# Altium schematic sheet lpGBT-Power.SchDoc: lpGBT Power
size A; DocumentNumber: 10; SheetNumber: 10; SheetTotal: 22
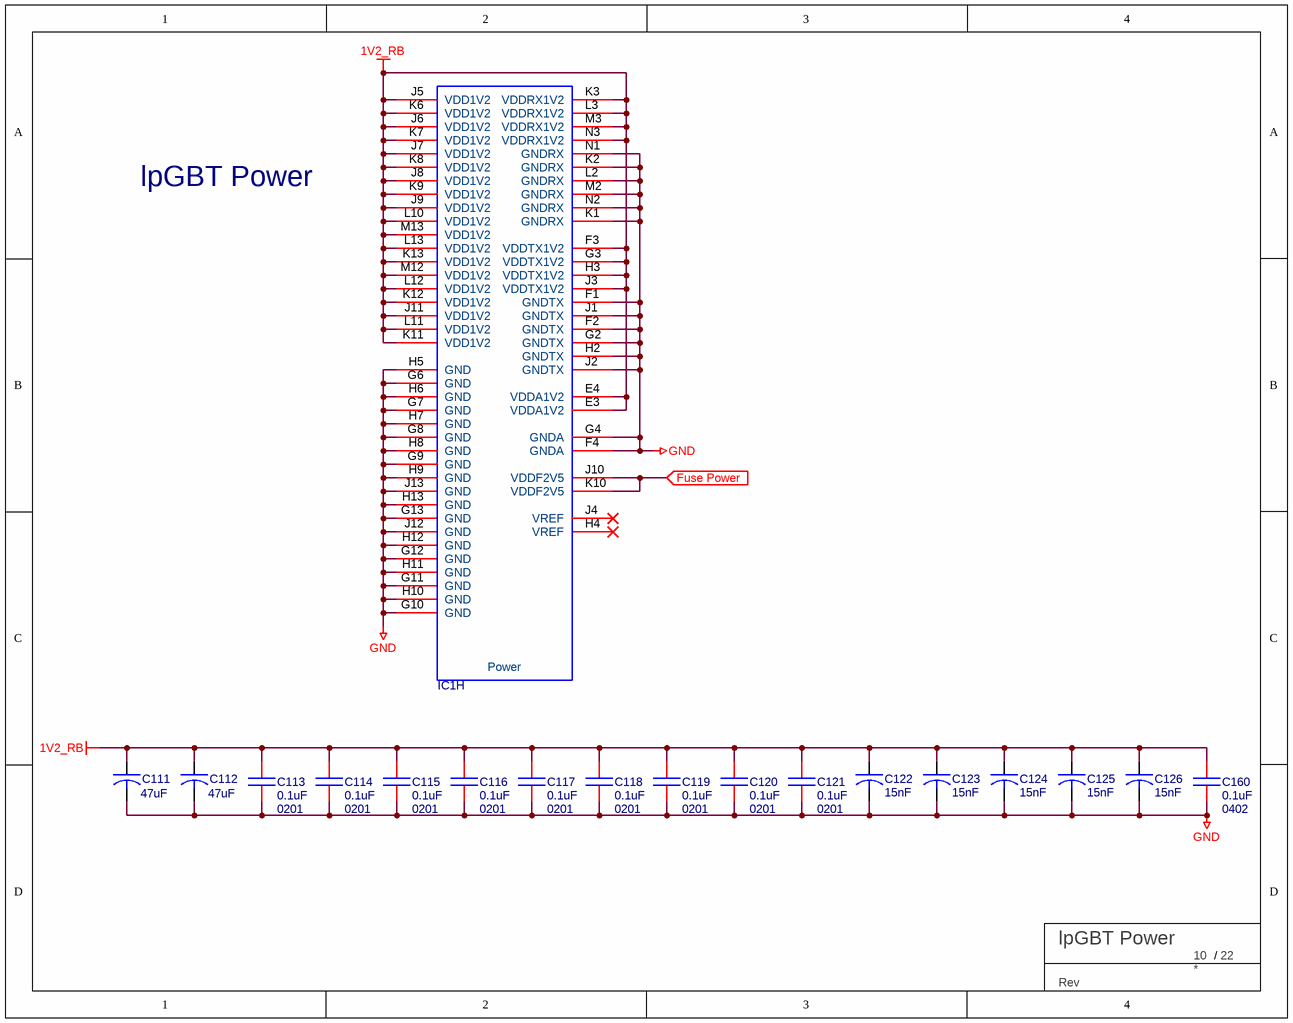
[diagram p0: lpGBT-Power.SchDoc]

## Parts
C111  value 47uF  [capc2012n]  (hidden comment: GRM188R60J476ME15D)
C112  value 47uF  [capc2012n]  (hidden comment: GRM188R60J476ME15D)
C113  Package: 0201  [C_0201_IPC]  (hidden comment: 0.1uF)
C114  Package: 0201  [C_0201_IPC]  (hidden comment: 0.1uF)
C115  Package: 0201  [C_0201_IPC]  (hidden comment: 0.1uF)
C116  Package: 0201  [C_0201_IPC]  (hidden comment: 0.1uF)
C117  Package: 0201  [C_0201_IPC]  (hidden comment: 0.1uF)
C118  Package: 0201  [C_0201_IPC]  (hidden comment: 0.1uF)
C119  Package: 0201  [C_0201_IPC]  (hidden comment: 0.1uF)
C120  Package: 0201  [C_0201_IPC]  (hidden comment: 0.1uF)
C121  Package: 0201  [C_0201_IPC]  (hidden comment: 0.1uF)
C122  value 15nF  [capc0603n]  (hidden comment: GRM033R61C153KE84D)
C123  value 15nF  [capc0603n]  (hidden comment: GRM033R61C153KE84D)
C124  value 15nF  [capc0603n]  (hidden comment: GRM033R61C153KE84D)
C125  value 15nF  [capc0603n]  (hidden comment: GRM033R61C153KE84D)
C126  value 15nF  [capc0603n]  (hidden comment: GRM033R61C153KE84D)
C160  0.1uF  Package: 0402  [C_0402_IPC_NOSILK]
IC1  LPGBT  [BGA289X17]  (value not drawn)  (part H of 8)
TBLOCK?  BU Title block  (value not drawn)  (graphical)

## Ports
Fuse Power (in)

## Nets
1V2_RB: C111.1 C112.1 C113.1 C114.1 C115.1 C116.1 C117.1 C118.1 C119.1 C120.1 C121.1 C122.1 C123.1 C124.1 C125.1 C126.1 C160.1 IC1.E3(VDDA1V2) IC1.E4(VDDA1V2) IC1.F3(VDDTX1V2) IC1.G3(VDDTX1V2) IC1.H3(VDDTX1V2) IC1.J3(VDDTX1V2) IC1.J5(VDD1V2) IC1.J6(VDD1V2) IC1.J7(VDD1V2) IC1.J8(VDD1V2) IC1.J9(VDD1V2) IC1.J11(VDD1V2) IC1.K3(VDDRX1V2) IC1.K6(VDD1V2) IC1.K7(VDD1V2) IC1.K8(VDD1V2) IC1.K9(VDD1V2) IC1.K11(VDD1V2) IC1.K12(VDD1V2) IC1.K13(VDD1V2) IC1.L3(VDDRX1V2) IC1.L10(VDD1V2) IC1.L11(VDD1V2) IC1.L12(VDD1V2) IC1.L13(VDD1V2) IC1.M3(VDDRX1V2) IC1.M12(VDD1V2) IC1.M13(VDD1V2) IC1.N3(VDDRX1V2)
GND: C111.2 C112.2 C113.2 C114.2 C115.2 C116.2 C117.2 C118.2 C119.2 C120.2 C121.2 C122.2 C123.2 C124.2 C125.2 C126.2 C160.2 IC1.F1(GNDTX) IC1.F2(GNDTX) IC1.F4(GNDA) IC1.G2(GNDTX) IC1.G4(GNDA) IC1.G6(GND) IC1.G7(GND) IC1.G8(GND) IC1.G9(GND) IC1.G10(GND) IC1.G11(GND) IC1.G12(GND) IC1.G13(GND) IC1.H2(GNDTX) IC1.H5(GND) IC1.H6(GND) IC1.H7(GND) IC1.H8(GND) IC1.H9(GND) IC1.H10(GND) IC1.H11(GND) IC1.H12(GND) IC1.H13(GND) IC1.J1(GNDTX) IC1.J2(GNDTX) IC1.J12(GND) IC1.J13(GND) IC1.K1(GNDRX) IC1.K2(GNDRX) IC1.L2(GNDRX) IC1.M2(GNDRX) IC1.N1(GNDRX) IC1.N2(GNDRX)
Fuse Power: IC1.J10(VDDF2V5) IC1.K10(VDDF2V5) ; port Fuse Power

Not connected (* = marked no-connect by the designer): IC1 H4(VREF)* J4(VREF)*

## Notes on the sheet
- lpGBT Power
- (in symbol LPGBT, part H) Power
- (in symbol TITLE_BLOCK_BU) /; Rev

## Library data of the parts
C111 C112 C122-C126 = C: CERAMIC CAPACITOR
C113-C121 = C-CER-E5-0.1uF-0201-16V-X5R: GRM033R61C104KE84D; Voltage: 16V; TempCo: X5R; VALUE: 0.1uF
C160 = C-CER-E5-0.1uF-0402-25V-X7R: GRM155R71E104ME14D; Voltage: 25V; TempCo: X7R
IC1 = LPGBT: Low Power Gigabit Transceiver; Manufacturer: CERN; Pinout Version: 180226; Bonding: No; Device: LPGBT; Manufacturer Part Number: LPGBT; SMD: Yes; Mounted: Yes; LatestRevisionDate: 26.10.2018; PackageDescription: BGA, 289-Leads, Body 9.00x9.00mmx1.28mm, Pitch 0.50mm; Part Description: Low Power Gigabit Transceiver; Case: BGA289; Part Number: LPGBT; Pin Count: 289; Socket: No; Component Kind: Standard; Component Type: Standard; Footprint: BGA289C50P17X17_900X900X128
TBLOCK? = TITLE_BLOCK_BU